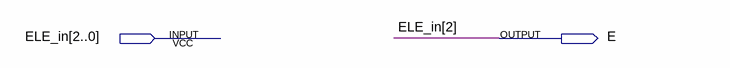
[diagram p0: schematic sheet]
// Quartus schematic DECOD_ELE_E.bdf as structural Verilog: 0 symbols, 2 pins
module DECOD_ELE_E (
  input  [2:0] ELE_in,
  output E
);


  assign E = ELE_in[2];
endmodule
